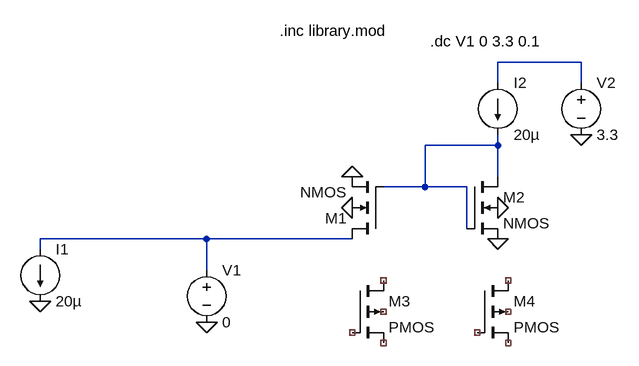
[diagram p0: schematic Draft5.asc]
Draft5.asc, the LTspice schematic file:
Version 4
SHEET 1 880 680
WIRE 480 96 352 96
WIRE 352 128 352 96
WIRE 480 128 480 96
WIRE 352 224 352 208
WIRE 352 224 240 224
WIRE 352 272 352 224
WIRE 240 288 240 224
WIRE 240 288 176 288
WIRE 304 288 240 288
WIRE 304 352 304 288
WIRE -96 368 -352 368
WIRE 128 368 -96 368
WIRE -352 384 -352 368
WIRE -96 416 -96 368
FLAG 128 320 0
FLAG 352 368 0
FLAG 352 320 0
FLAG 128 272 0
FLAG -352 464 0
FLAG -96 496 0
FLAG 480 208 0
SYMBOL voltage -96 400 R0
WINDOW 123 0 0 Left 0
WINDOW 39 0 0 Left 0
SYMATTR InstName V1
SYMATTR Value 0
SYMBOL voltage 480 112 R0
WINDOW 123 0 0 Left 0
WINDOW 39 0 0 Left 0
SYMATTR InstName V2
SYMATTR Value 3.3
SYMBOL nmos4 176 368 R180
SYMATTR InstName M1
SYMATTR Value2 l=1u w=1u
SYMBOL nmos4 304 272 R0
SYMATTR InstName M2
SYMATTR Value2 l=1u w=1u
SYMBOL current -352 384 R0
WINDOW 123 0 0 Left 0
WINDOW 39 0 0 Left 0
SYMATTR InstName I1
SYMATTR Value 20µ
SYMBOL current 352 128 R0
WINDOW 123 0 0 Left 0
WINDOW 39 0 0 Left 0
SYMATTR InstName I2
SYMATTR Value 20µ
SYMBOL pmos4 128 432 R0
SYMATTR InstName M3
SYMBOL pmos4 320 432 R0
SYMATTR InstName M4
TEXT 16 48 Left 2 !.inc library.mod
TEXT 248 64 Left 2 !.dc V1 0 3.3 0.1

The netlist it stands for:
* Draft5.asc
V1 N003 0 0
V2 N001 0 3.3
M1 N003 N002 0 0 NMOS l=1u w=1u
M2 N002 N002 0 0 NMOS l=1u w=1u
I1 N003 0 20µ
I2 N001 N002 20µ
M3 NC_01 NC_02 NC_03 NC_04 PMOS
M4 NC_05 NC_06 NC_07 NC_08 PMOS
.model NMOS NMOS
.model PMOS PMOS
.lib standard.mos
.inc library.mod
.dc V1 0 3.3 0.1
.backanno
.end